# EasyEDA schematic SCH_BlackboxHub_2024-05-23.json
TITLE: BlackBox; REV: 1.0; Date: 2024-04-22; Sheet: 1/1; Drawn By: trid3nt; Company: Hack Club
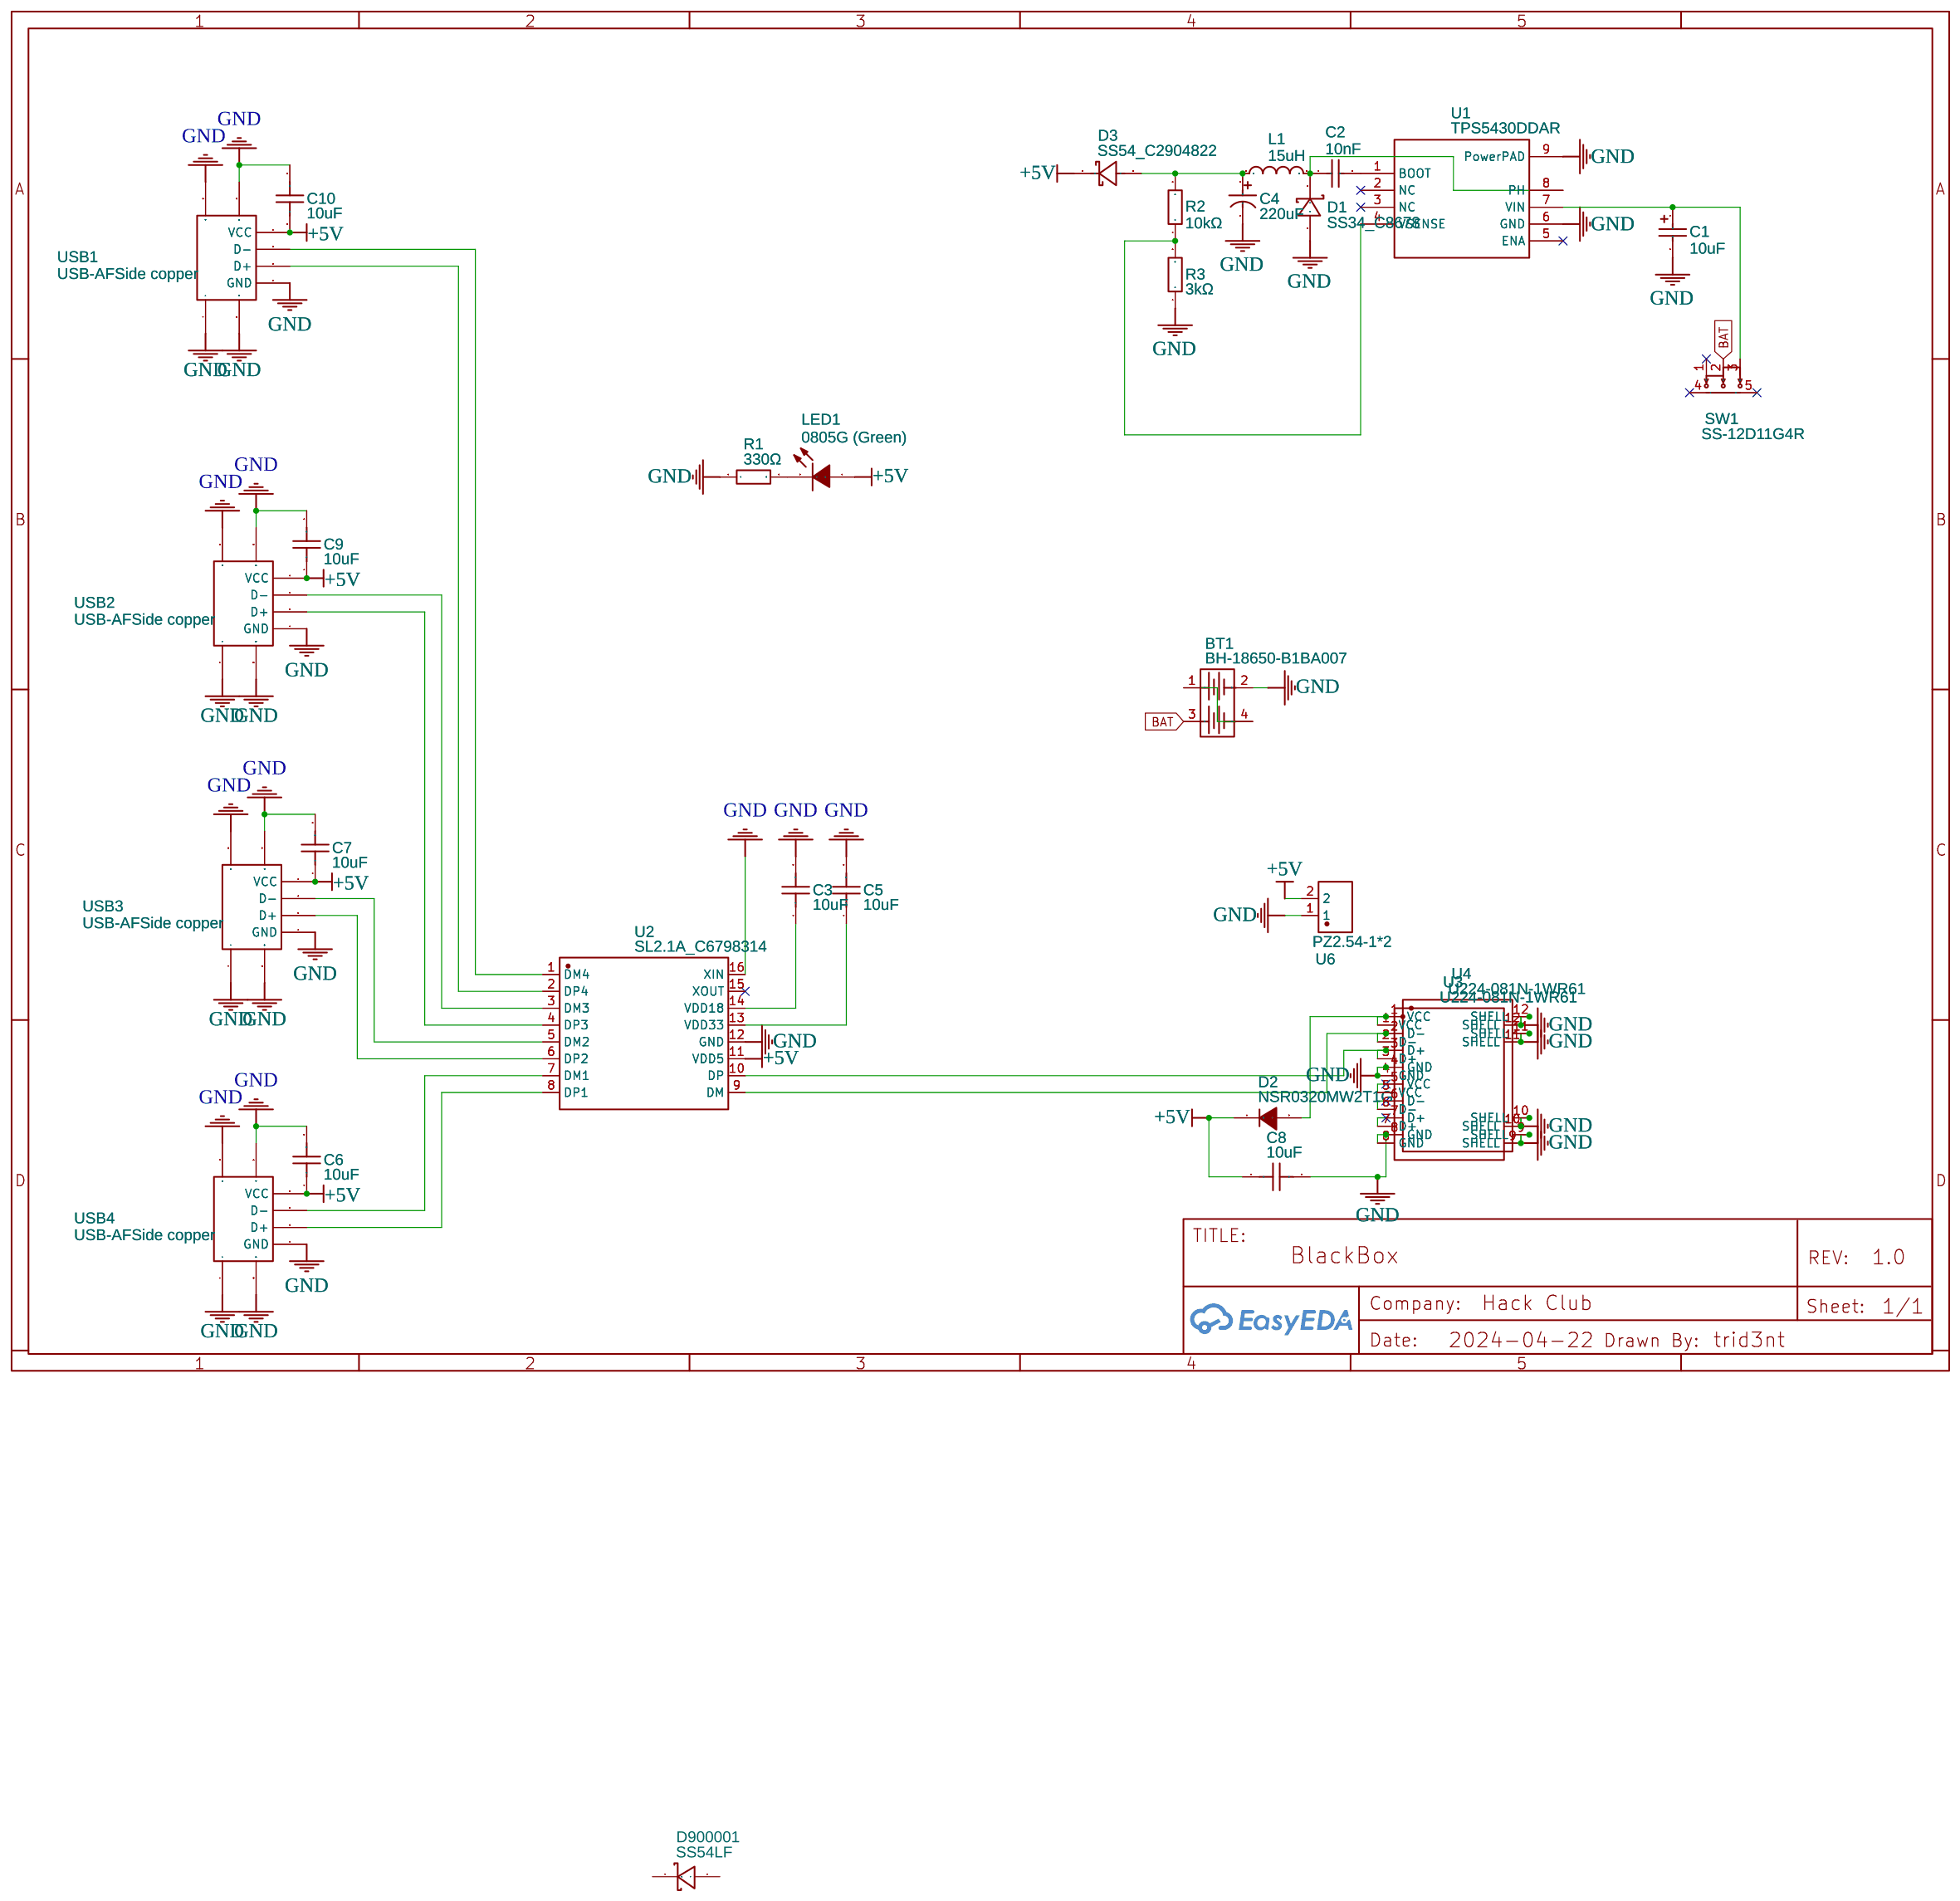
[diagram p0: schematic sheet]

## Parts
BT1  BH-18650-B1BA007  [BAT-SMD_BH-18650-B1BA007]
C1  10uF  [CAP-SMD_L3.2-W1.6-RD-C7171]
C2  10nF  [C0402]
C3  10uF  [C0603]
C4  220uF  [CAP-SMD_L7.3-W4.3-FD]
C5  10uF  [C0603]
C6  10uF  [C0603]
C7  10uF  [C0603]
C8  10uF  [C0603]
C9  10uF  [C0603]
C10  10uF  [C0603]
D1  SS34_C8678  [SMA_L4.3-W2.6-LS5.2-RD]
D2  NSR0320MW2T1G  [SOD-323_L1.8-W1.3-LS2.5-RD]
D3  SS54_C2904822  [SMB_L4.3-W3.6-LS5.4-RD]
D?#1  SS54LF
L1  15uH  [IND-SMD_L7.3-W6.6]
LED1  0805G (Green)  [LED0805-R-RD]
R1  330Ω  [R0805]
R2  10kΩ  [R0603]
R3  3kΩ  [R0603]
SW1  SS-12D11G4R  [SW-TH_SS-12D11G4R]
U1  TPS5430DDAR  [ESOP-8_L4.9-W3.9-P1.27-LS6.0-TL-EP]
U2  SL2.1A_C6798314  [SOP-16_L10.0-W3.9-P1.27-LS6.0-BL]
U3  U224-081N-1WR61  [USB-A-TH_XKB_U224-08XN-1XR61]
U4  U224-081N-1WR61  [USB-A-TH_XKB_U224-08XN-1XR61]
U6  PZ2.54-1*2  [HDR-TH_2P-P2.54-V-M-3]
USB1  USB-AFSide copper  [USB-A-TH_USB-M-2_C26235]
USB2  USB-AFSide copper  [USB-A-TH_USB-M-2_C26235]
USB3  USB-AFSide copper  [USB-A-TH_USB-M-2_C26235]
USB4  USB-AFSide copper  [USB-A-TH_USB-M-2_C26235]

## Library data of the parts
BT1 = BH-18650-B1BA007: Supplier: LCSC; Supplier Part: C6937126; Manufacturer: MYOUNG(美阳); JLCPCB Part Class: Extended Part; Contributor: lcsc
C1 = TAJA106K016RNJ: Supplier: LCSC; Manufacturer: Kyocera AVX; Supplier Part: C7171; JLCPCB Part Class: Basic Part
C2 = CL05B103KB5NNNC: Supplier: LCSC; Manufacturer: SAMSUNG(三星); Supplier Part: C15195; JLCPCB Part Class: Basic Part
C3 C5-C7 C9 C10 = CL10A106KP8NNNC: Supplier: LCSC; Manufacturer: SAMSUNG(三星); Supplier Part: C19702; JLCPCB Part Class: Basic Part; link: https://lcsc.com/eda_search?q=C19702&%26type=1&ref=editor
C4 = 10TPB220M: Contributor: LCSC; Supplier: LCSC; Supplier Part: C242173; Manufacturer: PANASONIC(松下); JLCPCB Part Class: Extended Part
C8 = CL10A106KP8NNNC: Supplier: LCSC; Manufacturer: SAMSUNG(三星); Supplier Part: C19702; JLCPCB Part Class: Basic Part
D1 = SS34_C8678: Supplier: LCSC; Manufacturer Part: SS34; Manufacturer: MDD; Supplier Part: C8678; JLCPCB Part Class: Basic Part
D2 = NSR0320MW2T1G: Supplier: LCSC; Manufacturer: onsemi(安森美); Supplier Part: C48192; JLCPCB Part Class: Extended Part
D3 = SS54_C2904822: Contributor: LCSC; Supplier: LCSC; Supplier Part: C2904822; Manufacturer: YONGYUTAI(永裕泰); Manufacturer Part: SS54; JLCPCB Part Class: Extended Part
D?#1 = SS54LF: Manufacturer: 晶导微电子; Supplier Part: C128733; Supplier: LCSC
L1 = MDA7050-150M: Contributor: LCSC; Supplier: LCSC; Supplier Part: C2847544; Manufacturer: KOHERelec(科或); JLCPCB Part Class: Extended Part
LED1 = 0805G (Green): Supplier: LCSC; Manufacturer: KENTO; Manufacturer Part: KT-0805G; Supplier Part: C2297; JLCPCB Part Class: Basic Part
R1 = 0805W8F3300T5E: Supplier: LCSC; Manufacturer: UNI-ROYAL(厚声); Supplier Part: C17630; JLCPCB Part Class: Basic Part
R2 = 0603WAF1002T5E: Supplier: LCSC; Manufacturer: UNI-ROYAL(厚声); Supplier Part: C25804; JLCPCB Part Class: Basic Part
R3 = 0603WAF3001T5E: Supplier: LCSC; Manufacturer: UNI-ROYAL(厚声); Supplier Part: C4211; JLCPCB Part Class: Basic Part
SW1 = SS-12D11G4R: Contributor: LCSC; Supplier: LCSC; Supplier Part: C843370; Manufacturer: XKB Connectivity(中国星坤); JLCPCB Part Class: Extended Part
U1 = TPS5430DDAR: Supplier: LCSC; Manufacturer: TI(德州仪器); Supplier Part: C9864; JLCPCB Part Class: Basic Part
U2 = SL2.1A_C6798314: Contributor: lcsc; Supplier: LCSC; Supplier Part: C6798314; Manufacturer: CoreChips(和芯润德); Manufacturer Part: SL2.1A; JLCPCB Part Class: Extended Part
U3 U4 = U224-081N-1WR61: Contributor: lcsc; Supplier: LCSC; Supplier Part: C2880657; Manufacturer: XKB Connectivity(中国星坤); JLCPCB Part Class: Extended Part
U6 = PZ2.54-1*2: Contributor: lcsc; Supplier: LCSC; Supplier Part: C5360898; Manufacturer: ZHOURI(洲日); JLCPCB Part Class: Extended Part
USB1-USB4 = USB-AFSide copper: Supplier: LCSC; Manufacturer: 精拓金; Manufacturer Part: USB-AF侧插铜; Supplier Part: C26235; JLCPCB Part Class: Extended Part

## Nets
+5V: C6.1 C7.1 C8.1 C9.1 C10.1 D2.1(C) D3.1(K) LED1.1(A) U2.11(VDD5) U6.2 USB1.1(VCC) USB2.1(VCC) USB3.1(VCC) USB4.1(VCC)
GND: BT1.2 C1.2 C3.2 C4.2 C5.2 C6.2 C7.2 C8.2 C9.2 C10.2 D1.2(A) R1.1 R3.1 U1.6(GND) U1.9(PowerPAD) U2.12(GND) U2.16(XIN) U3.4(GND) U3.8(GND) U3.9(SHELL) U3.10(SHELL) U3.11(SHELL) U3.12(SHELL) U4.4(GND) U4.8(GND) U4.9(SHELL) U4.10(SHELL) U4.11(SHELL) U4.12(SHELL) U6.1 USB1.4(GND) USB1.5 USB1.6 USB1.7 USB1.8 USB2.4(GND) USB2.5 USB2.6 USB2.7 USB2.8 USB3.4(GND) USB3.5 USB3.6 USB3.7 USB3.8 USB4.4(GND) USB4.5 USB4.6 USB4.7 USB4.8
BAT: BT1.3 SW1.2
Net-(BT1-Pad1): BT1.1 BT1.4
Net-(D1-K): C2.1 D1.1(K) L1.2 U1.8(PH)
Net-(D2-A): D2.2(A) U3.1(VCC) U4.1(VCC)
Net-(D3-A): C4.1 D3.2(A) L1.1 R2.2
Net-(LED1-K): LED1.2(K) R1.2
Net-(U1-BOOT): C2.2 U1.1(BOOT)
Net-(U1-VIN): C1.1 SW1.3 U1.7(VIN)
Net-(U1-VSENSE): R2.1 R3.2 U1.4(VSENSE)
Net-(U2-DM1): U2.7(DM1) USB4.2(D-)
Net-(U2-DM2): U2.5(DM2) USB3.2(D-)
Net-(U2-DM3): U2.3(DM3) USB2.2(D-)
Net-(U2-DM4): U2.1(DM4) USB1.2(D-)
Net-(U2-DM): U2.9(DM) U3.2(D-) U4.2(D-)
Net-(U2-DP1): U2.8(DP1) USB4.3(D+)
Net-(U2-DP2): U2.6(DP2) USB3.3(D+)
Net-(U2-DP3): U2.4(DP3) USB2.3(D+)
Net-(U2-DP4): U2.2(DP4) USB1.3(D+)
Net-(U2-DP): U2.10(DP) U3.3(D+) U4.3(D+)
Net-(U2-VDD18): C3.1 U2.14(VDD18)
Net-(U2-VDD33): C5.1 U2.13(VDD33)

Not connected (* = marked no-connect by the designer): D?#1 1(C) 2(A); SW1 1* 4* 5*; U1 2(NC)* 3(NC)* 5(ENA)*; U2 15(XOUT)*; U3 5(VCC) 6(D-) 7(D+); U4 5(VCC) 6(D-) 7(D+)
